# Altium schematic sheet Contactor.SchDoc
size A4; SheetNumber: 6; SheetTotal: 6
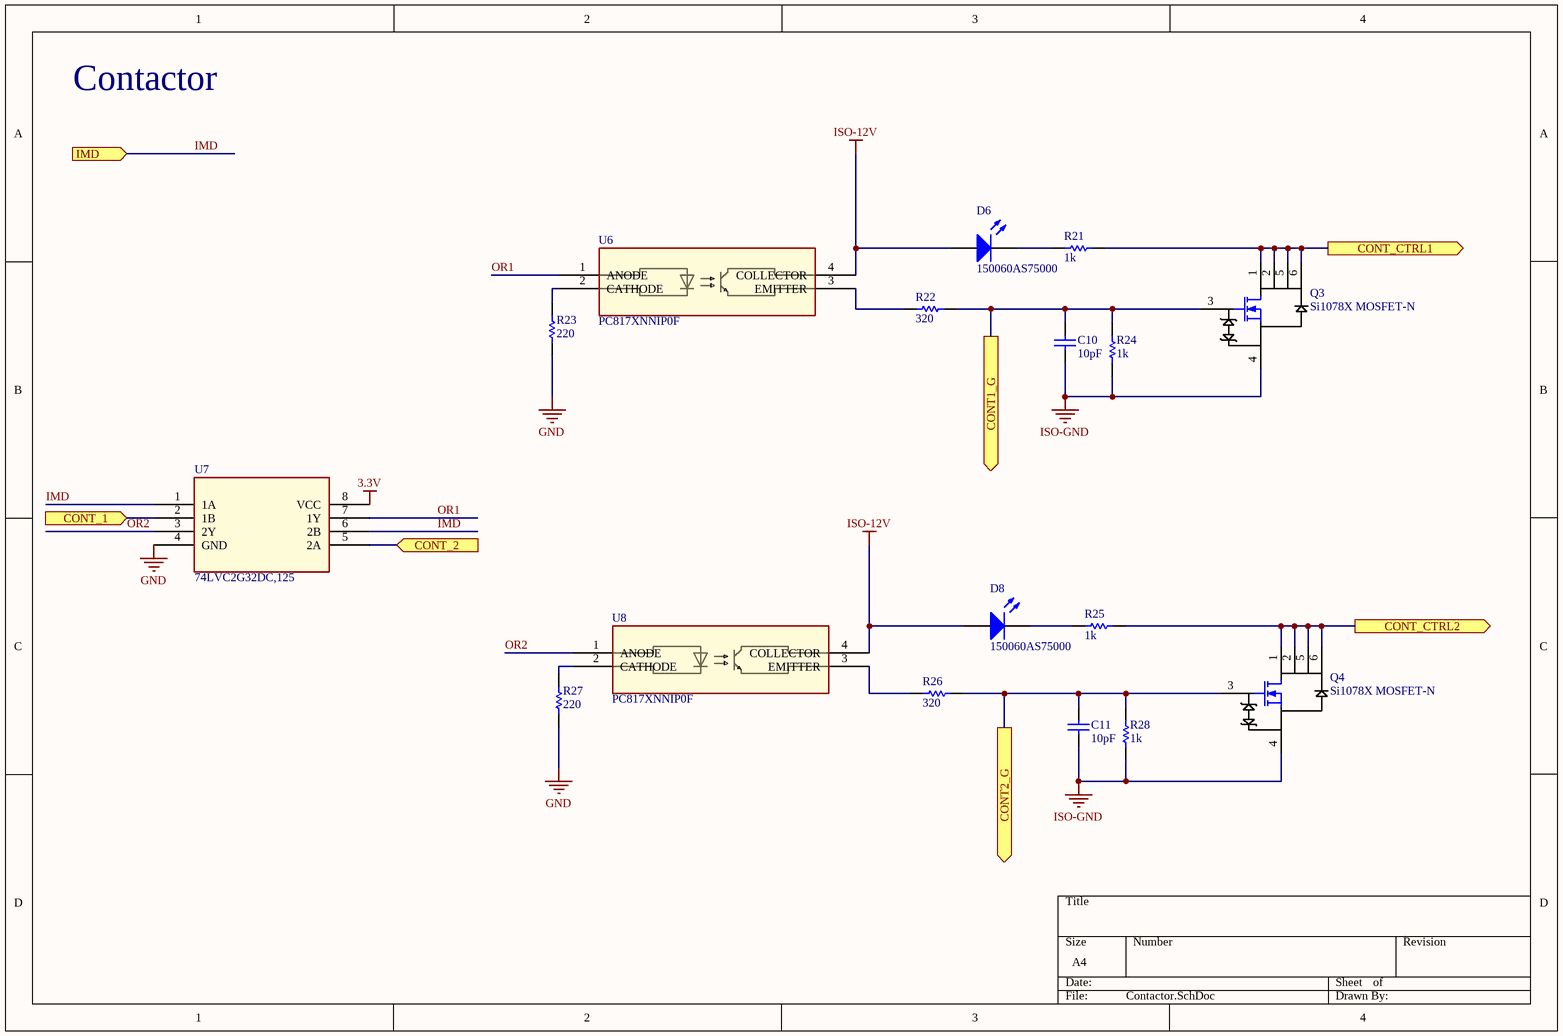
[diagram p0: Contactor.SchDoc]

## Parts
C10  value 10pF  [0603 - Capacitor]  (hidden comment: Capacitor - Nonpolarized)
C11  value 10pF  [0603 - Capacitor]  (hidden comment: Capacitor - Nonpolarized)
D6  150060AS75000  [0603 - Resistor]
D8  150060AS75000  [0603 - Resistor]
Q3  Si1078X MOSFET-N  [Si1078X NMOS 30V]
Q4  Si1078X MOSFET-N  [Si1078X NMOS 30V]
R21  value 1k  [0603 - Resistor]  (hidden comment: Resistor)
R22  value 320  [0603 - Resistor]  (hidden comment: Resistor)
R23  value 220  [0603 - Resistor]  (hidden comment: Resistor)
R24  value 1k  [0603 - Resistor]  (hidden comment: Resistor)
R25  value 1k  [0603 - Resistor]  (hidden comment: Resistor)
R26  value 320  [0603 - Resistor]  (hidden comment: Resistor)
R27  value 220  [0603 - Resistor]  (hidden comment: Resistor)
R28  value 1k  [0603 - Resistor]  (hidden comment: Resistor)
U6  PC817XNNIP0F  [PC817XNNIP0F_SHP]
U7  74LVC2G32DC,125  [VSSOP8_SOT765-1_NEX]
U8  PC817XNNIP0F  [PC817XNNIP0F_SHP]

## Ports
CONT1_G (out), CONT2_G (out), CONT_1 (in), CONT_2 (in), CONT_CTRL1 (out), CONT_CTRL2 (out), IMD (in)

## Nets
3.3V: U7.8(VCC)
GND: R23.1 R27.1 U7.4(GND)
ISO-12V: D6.1(A) D8.1(A) U6.4(COLLECTOR) U8.4(COLLECTOR)
ISO-GND: C10.1 C11.1 Q3.4 Q4.4 R24.1 R28.1
CONT1_G: C10.2 Q3.3 R22.2 R24.2 ; port CONT1_G
CONT2_G: C11.2 Q4.3 R26.2 R28.2 ; port CONT2_G
CONT_1: U7.2(1B) ; port CONT_1
CONT_2: U7.5(2A) ; port CONT_2
CONT_CTRL1: Q3.1(G) Q3.2(D) Q3.5 Q3.6 R21.1 ; port CONT_CTRL1
CONT_CTRL2: Q4.1(G) Q4.2(D) Q4.5 Q4.6 R25.1 ; port CONT_CTRL2
IMD: U7.1(1A) U7.6(2B) ; port IMD
OR1: U6.1(ANODE) U7.7(1Y)
OR2: U7.3(2Y) U8.1(ANODE)
NetD6_2: D6.2(K) R21.2
NetD8_2: D8.2(K) R25.2
NetR22_1: R22.1 U6.3(EMITTER)
NetR23_2: R23.2 U6.2(CATHODE)
NetR26_1: R26.1 U8.3(EMITTER)
NetR27_2: R27.2 U8.2(CATHODE)

## Notes on the sheet
- Contactor

## Library data of the parts
C10 C11 = Capacitor - Nonpolarized: Nonpolarized Capacitor; Supplier Part Number: *; Supplier: *; Manufacturer: *; Rating: *; Manufacturer Part Number: *
D6 D8 = LED: Amber 605nm LED Indication - Discrete 2V 0603 (1608 Metric); Manufacturer: Würth Elektronik; Value: *; Manufacturer Part Number: 150060AS75000; Supplier Part Number: 732-150060AS75000CT-ND; Rating: *; Supplier: Digi-Key
Q3 Q4 = Si1078X MOSFET-N: N-Channel 30 V (D-S) MOSFET; Manufacturer Name: Vishay Semiconductors; Manufacturer Part Number: SI1078X-T1-GE3; Supplier Name: Mouser; Supplier Part Number: 78-SI1078X-T1-GE3; ComponentLink1Description: Mouser; ComponentLink1URL: https://www.mouser.ca/ProductDetail/Vishay-Semiconductors/SI1078X-T1-GE3?qs=EBLjwc9jJJulNr1%252B%2FwN60A%3D%3D
U6 U8 = PC817XNNIP0F: Transistor Output Optocouplers Photocoupler; Manufacturer Name: Sharp; Manufacturer Part Number: PC817XNNIP0F; Type: DEV; Supplier: Mouser; Supplier Part Number: 852-PC817X3NIP1B
U7 = 74LVC2G32DC,125: IC GATE OR 2CH 2-INP 8TSSOP; Manufacturer Name: Nexperia; Manufacturer Part Number: 74LVC2G32DC,125; Supplier Name: Digikey; Supplier Part Number: 1727-5991-2-ND
R21-R28 = Resistor: Rating: *; Manufacturer Part Number: *; Manufacturer: *; Supplier Part Number: *; Supplier: *